# Altium project LimeSDR-XTRX_1v4.PrjPcb (part 5 of 8)
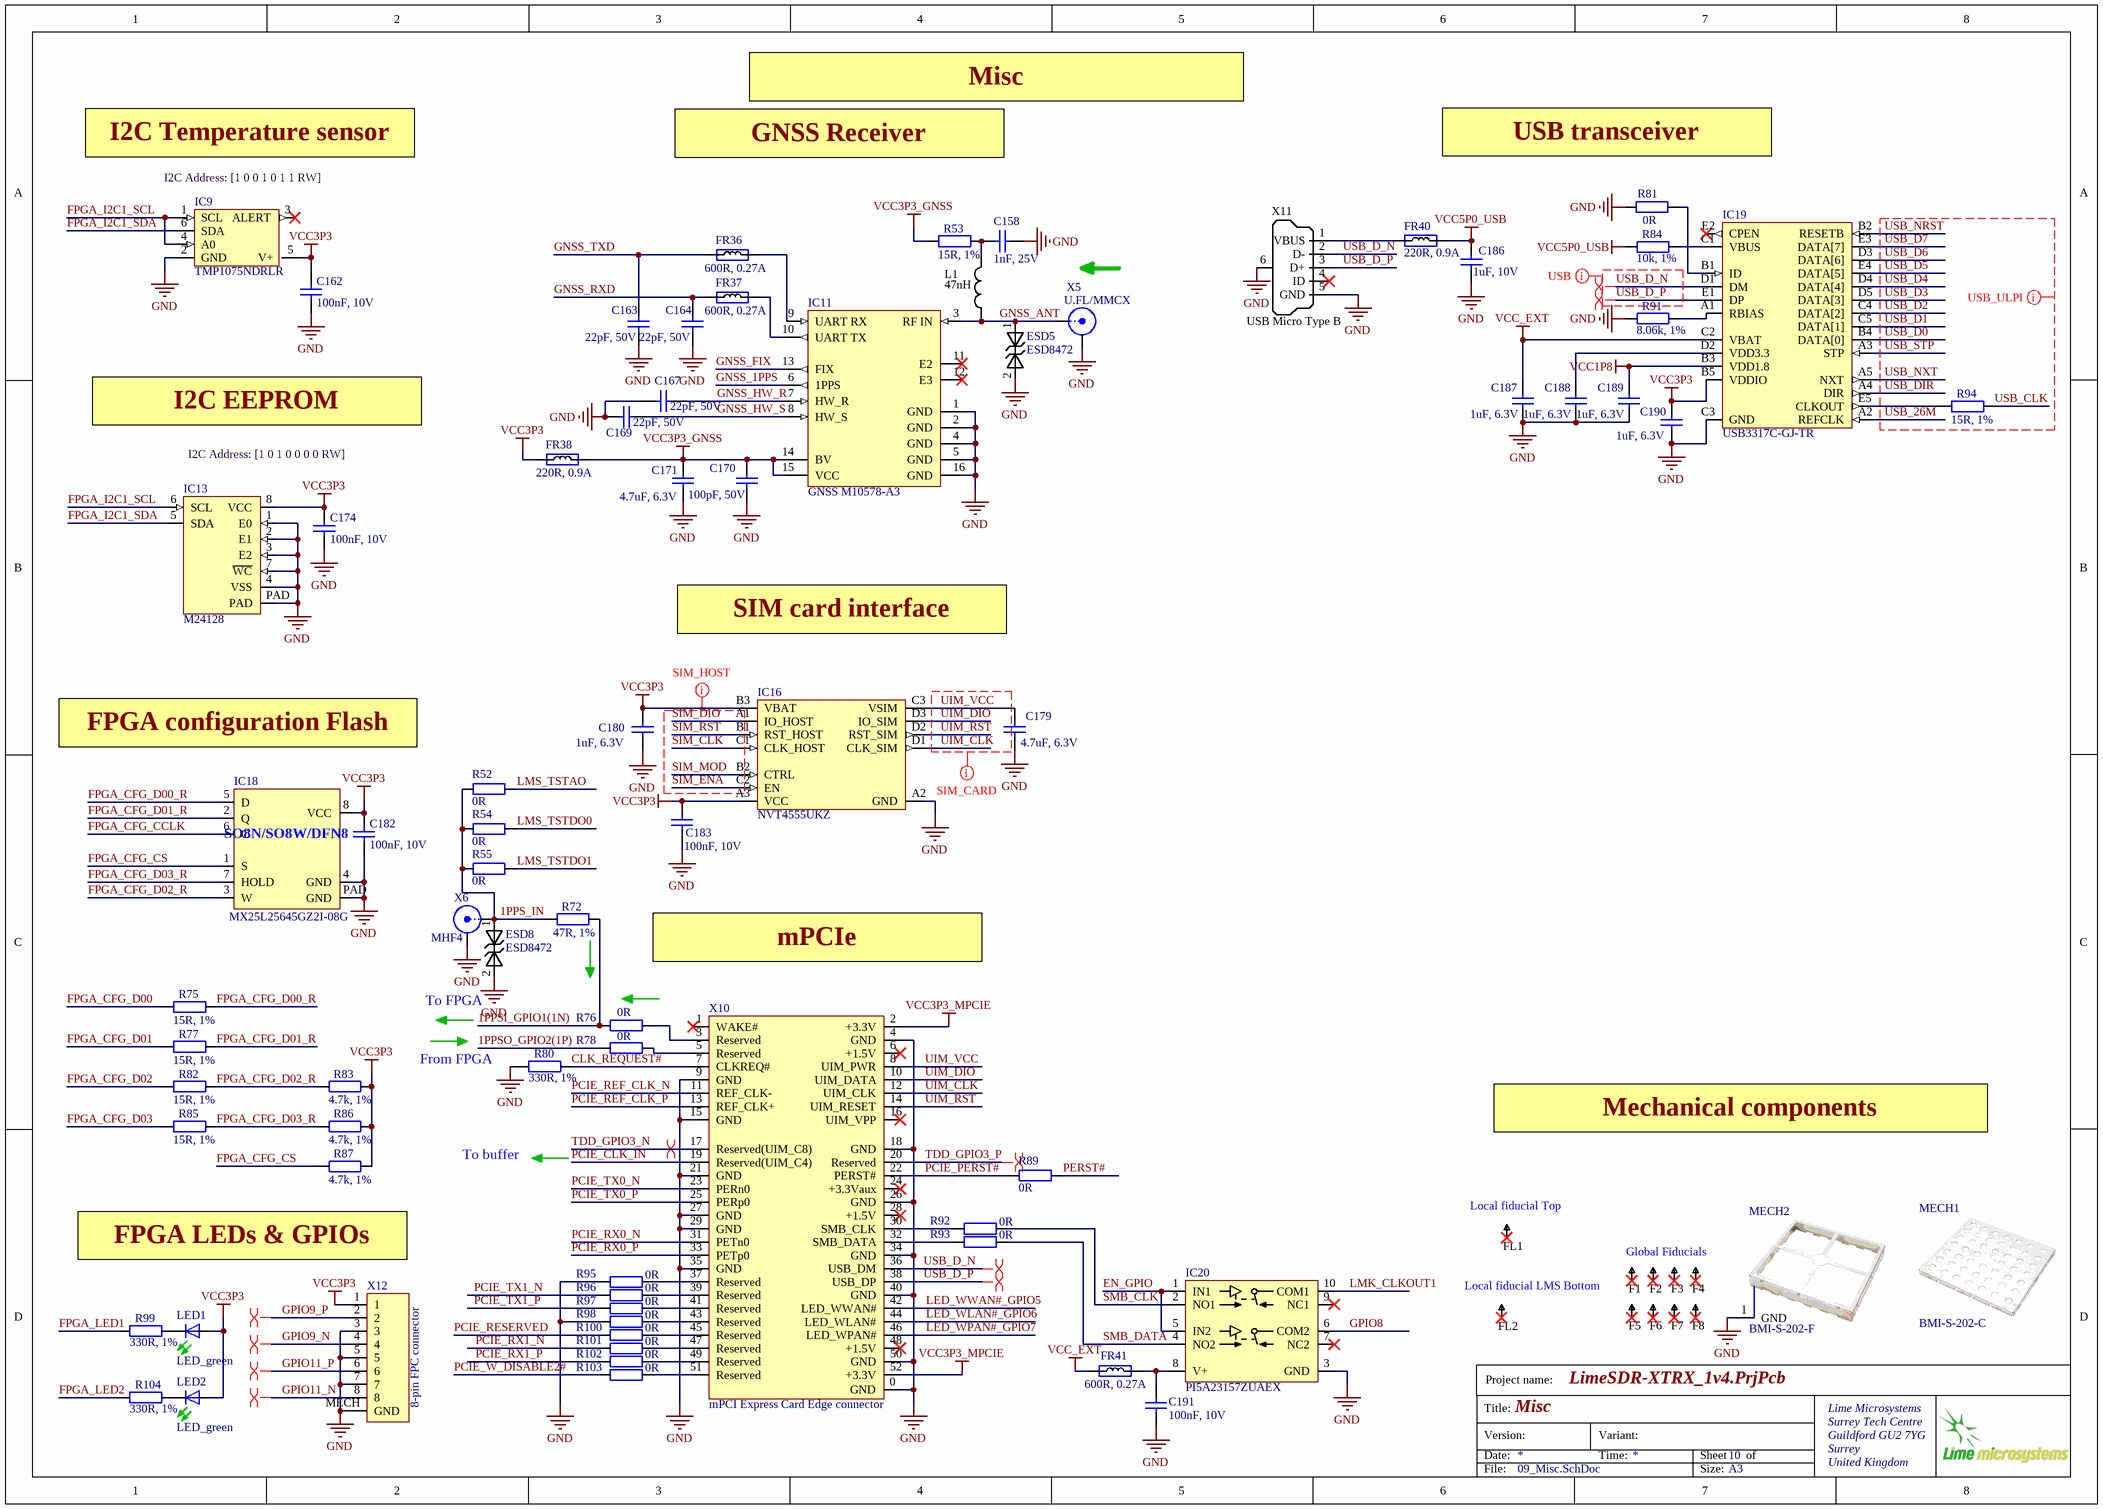
[diagram p11: 09_Misc.SchDoc]

## Sheet 09_Misc.SchDoc: Misc (continued)

### Library data of the parts
C158 = Cap_0402: Manufacturer Part Number 1: C0603X7R1E102K030BA; Manufacturer: TDK Corporation; Part Description: 1000pF ±10% 25V X7R Ceramic Capacitor -55°C ~ 125°C Surface Mount, MLCC 0201 (0603 Metric) 0.024" L x 0.012" W (0.60mm x 0.30mm); Temperature Coefficient: X7R; Tolerance: ±10%; Capacitance: 1000pF; Value: 1nF, 25V; Supplier 1: Digi-Key; Supplier Part Number 1: 445-7275-1-ND; Voltage - Rated: 25V; Features: -; Package / Case: 0201 (0603 Metric); Lead Spacing: -; Mounting Type: Surface Mount, MLCC; Lead Style: -; Height - Seated (Max): -; Operating Temperature: -55°C ~ 125°C; Size / Dimension: 0.024" L x 0.012" W (0.60mm x 0.30mm); Applications: General Purpose; Ratings: -; Thickness (Max): 0.013" (0.33mm); RoHS: RoHS Compliant; Packaging: Cut Tape (CT); Category: Capacitors
C162 C174 C182 C183 C191 = Cap_0402: Part Description: 0.1 µF ±20% 10V Ceramic Capacitor X5R 0201 (0603 Metric); Manufacturer: Samsung; Manufacturer Part Number 1: CL03A104MP3NNNC; Tolerance: 20%; Value: 100nF, 10V; Capacitance: 100nF; Case/Package: 0201; Case Code (Imperial): 0201; Case Code (Metric): 0603; ComponentLink5Description: https://datasheet.ciiva.com/25788/cl03a104mp3nnnc-25788272.pdf?src-supplier=Digi-Key; ComponentLink5URL: https://datasheet.ciiva.com/25788/cl03a104mp3nnnc-25788272.pdf?src-supplier=Digi-Key; Length: 0.024inch; Max Operating Temperature: 85°C; Min Operating Temperature: -55°C; Mount: Surface Mount; Package Quantity: 1; Packaging: Tape and Reel; Pricing 1: 1=0,10000, 10=0,03000, 50=0,01640, 100=0,01330, 500=0,00950, 1000=0,00747, 2500=0,00679, 5000=0,00625 (USD); RoHS: Yes; RoHS Compliant: Yes; Series: CL; Stock 1: 3817176; Supplier 1: Digi-Key; Supplier Part Number 1: 1276-1321-1-ND; Thickness: 0.013inch; Voltage Rating (DC): 10V; Voltage Rating: 10V; Width: 0.012inch
C163 C164 C167 C169 = Cap_0402: Manufacturer: Murata; Manufacturer Part Number 1: GRM0335C1H220JA01D; Part Description: 22 pF ±5% 50V Ceramic Capacitor C0G, NP0 0201 (0603 Metric); Tolerance: 5%; Dielectric: C0G; Value: 22pF, 50V; Supplier 1: Digi-Key; Supplier Part Number 1: 490-6123-1-ND; Stock 1: 2966748; Pricing 1: 1=0,10000, 10=0,01300, 50=0,00720, 100=0,00590, 500=0,00424, 1000=0,00333, 2500=0,00303, 5000=0,00279 (USD); RoHS: Yes; Mount: Surface Mount; Case/Package: 0201; Case Code (Metric): 0603; Case Code (Imperial): 0201; Min Operating Temperature: -55°C; Max Operating Temperature: 125°C; Package Quantity: 15000; Capacitance: 22pF; Voltage Rating: 50V; Packaging: Tape and Reel; Termination: SMD/SMT; Voltage: 50V; Voltage Rating (DC): 50V; Series: GRM; Length: 0.6mm; Width: 0.012inch; Height: 0.3mm; Thickness: 0.013inch; Depth: 0.3mm; Lead Free: Lead Free; RoHS Compliant: Yes; ComponentLink1URL: https://datasheet.ciiva.com/6271/partnumbering-e-01-6271146.pdf?src-supplier=Digi-Key; ComponentLink1Description: https://datasheet.ciiva.com/6271/partnumbering-e-01-6271146.pdf?src-supplier=Digi-Key; ComponentLink2URL: https://datasheet.ciiva.com/6271/partnumbering-e-01-6271143.pdf?src-supplier=Digi-Key; ComponentLink2Description: https://datasheet.ciiva.com/6271/partnumbering-e-01-6271143.pdf?src-supplier=Digi-Key; ComponentLink3URL: https://datasheet.ciiva.com/6271/partnumbering-e-01-6271149.pdf?src-supplier=Digi-Key; ComponentLink3Description: https://datasheet.ciiva.com/6271/partnumbering-e-01-6271149.pdf?src-supplier=Digi-Key
C170 = Cap_0402: Part Description: 100 pF ±5% 50V Ceramic Capacitor C0G, NP0 0201 (0603 Metric); Manufacturer: TDK; Manufacturer Part Number 1: C0603C0G1H101J030BA; Dielectric: C0G; Dielectric Material: Ceramic; Insulation Resistance: 10GR; Tolerance: 5%; Value: 100pF, 50V; Capacitance: 100pF; Case/Package: 0201; Case Code (Imperial): 0201; Case Code (Metric): 0603; ComponentLink1Description: https://datasheet.ciiva.com/24217/c0603c0g1h101j030ba-264106-24217425.pdf?src-supplier=Mouser; ComponentLink1URL: https://datasheet.ciiva.com/24217/c0603c0g1h101j030ba-264106-24217425.pdf?src-supplier=Mouser; ComponentLink2Description: https://datasheet.ciiva.com/16205/mlcc-commercial-general-en-16205590.pdf?src-supplier=Future+Electronics; ComponentLink2URL: https://datasheet.ciiva.com/16205/mlcc-commercial-general-en-16205590.pdf?src-supplier=Future+Electronics; ComponentLink3Description: https://datasheet.ciiva.com/6250/tdkmlcccaprange-6250351.pdf?src-supplier=Digi-Key; ComponentLink3URL: https://datasheet.ciiva.com/6250/tdkmlcccaprange-6250351.pdf?src-supplier=Digi-Key; Construction: Flat; Depth: 0.3mm; Height: 0.3mm; Lead Free: Lead Free; Length: 0.6mm; Max Operating Temperature: 125°C; Min Operating Temperature: -55°C; Mount: Surface Mount; Number of Pins: 2; Package Quantity: 1; Packaging: Tape and Reel; Pricing 1: 1=0,10000, 10=0,06000, 50=0,03280, 100=0,02670, 500=0,01908, 1000=0,01500, 2500=0,01364, 5000=0,01254 (USD); Reach SVHC Compliant: Yes; RoHS: Yes; RoHS Compliant: Yes; Series: C; Stock 1: 367528; Supplier 1: Digi-Key; Supplier Part Number 1: 445-1786-1-ND; Termination: SMD/SMT; Thickness: 0.013inch; Voltage: 50V; Voltage Rating (DC): 50V; Voltage Rating: 50V; Weight: 6E-06oz; Width: 0.012inch
C171 C179 = Cap_0402: Manufacturer: Murata Electronics North America; Manufacturer Part Number 1: GRM155R60J475ME87D; Part Description: 4.7µF ±20% 6.3V X5R Ceramic Capacitor -55°C ~ 85°C Surface Mount, MLCC 0402 (1005 Metric) 0.039" L x 0.020" W (1.00mm x 0.50mm); Tolerance: ±20%; Capacitance: 4.7µF; Temperature Coefficient: X5R; Lead Style: -; Ratings: -; Height - Seated (Max): -; Thickness (Max): 0.022" (0.55mm); Voltage - Rated: 6.3V; Packaging: Cut Tape (CT); Lead Spacing: -; Category: Capacitors; Supplier Part Number 1: 490-5408-1-ND; Applications: General Purpose; Operating Temperature: -55°C ~ 85°C; Mounting Type: Surface Mount, MLCC; Features: Derating Recommended; RoHS: RoHS Compliant; Supplier 1: Digi-Key; Package / Case: 0402 (1005 Metric); Size / Dimension: 0.039" L x 0.020" W (1.00mm x 0.50mm); Value: 4.7uF, 6.3V
C180 C187-C190 = Cap_0402: Manufacturer: TDK Corporation; Manufacturer Part Number 1: JMK063ABJ105MP-F; Part Description: 1µF ±20% 6.3V X5R Ceramic Capacitor -55°C ~ 85°C Surface Mount, MLCC 0201 (0603 Metric) 0.024" L x 0.012" W (0.60mm x 0.30mm); Value: 1uF, 20%; Tolerance: ±20%; Capacitance: 1.0µF; Temperature Coefficient: X5R; Supplier 1: Digi-Key; Supplier Part Number 1: 587-5864-2-ND; Applications: General Purpose; Features: -; Lead Style: -; Ratings: -; Thickness (Max): -; Lead Spacing: -; Height - Seated (Max): -; Size / Dimension: 0.024" L x 0.012" W (0.60mm x 0.30mm); Mounting Type: Surface Mount, MLCC; Operating Temperature: -55°C ~ 85°C; Package / Case: 0201 (0603 Metric); Packaging: Cut Tape (CT); Voltage - Rated: 6.3V; Category: Capacitors; RoHS: RoHS Compliant
C186 = Cap_0402: Manufacturer Part Number 1: C1005X5R1E105K050BC; Manufacturer: TDK; Part Description: 1µF ±10% 10V X5R Ceramic Capacitor -55°C ~ 85°C Surface Mount, MLCC 0402 (1005 Metric) 0.039" L x 0.020" W (1.00mm x 0.50mm); Voltage Rating: 10; Capacitance Tolerance: ± 10%; Product Range: TDK - C Series; Ceramic Capacitor Case: 0402 [1005 Metric]; Capacitance: 1; Dielectric Characteristic: X6; Value: 1uF, 10V; Supplier 1: Digi-Key; Supplier Part Number 1: 445-9066-1-ND; MSL: -; RoHS: YES
ESD5 ESD8 = ESD8472: Manufacturer: ON Semiconductor; Manufacturer Part Number 1: ESD8472MUT5G; Part Description: TVS DIODE 5.3VWM 14VC X3DFN2; Voltage - Reverse Standoff (Typ): 5.3V (Max); Voltage - Breakdown (Min): 7V; Voltage - Clamping (Max) @ Ipp: 14V; Current - Peak Pulse (10/1000µs): 3A (8/20µs); Power Line Protection: No; Capacitance @ Frequency: 0.2pF @ 1MHz; Supplier 1: Digi-Key; RoHS: RoHS Compliant; Category: Circuit Protection; Stock 1: 2295; Pricing 1: 1=0.39, 10=0.315, 100=0.2142, 500=0.16068, 1000=0.12051 (USD); Packaging: Cut Tape (CT); Part Status: Active; Type: Zener; Power - Peak Pulse: -; Applications: Automotive, RF Antenna; Operating Temperature: -55°C ~ 150°C (TJ); Mounting Type: Surface Mount; Package / Case: 2-XFDFN; Supplier Device Package: 2-X3DFN (0.62x0.32); ComponentLink1URL: http://www.onsemi.com/pub/Collateral/ESD8472-D.PDF; ComponentLink1Description: http://www.onsemi.com/pub/Collateral/ESD8472-D.PDF; Supplier Part Number 1: ESD8472MUT5GOSCT-ND
FR36 FR37 = Ferrite: Manufacturer Part Number 1: BK0603TS601-T; Manufacturer: Taiyo Yuden; Part Description: FERRITE BEAD 600 OHM 0201 1LN; DC Resistance (DCR): 750 mOhm Max; Filter Type: Differential Mode - Single; Impedance @ Frequency: 600 Ohm @ 100MHz; Current Rating: 270mA; Value: 600R@100MHz; Supplier 1: Digi-Key; Supplier Part Number 1: 587-3277-1-ND; Size / Dimension: 0.024" L x 0.012" W (0.60mm x 0.30mm); Package / Case: 0201 (0603 Metric); Height (Max): 0.013" (0.33mm); Mounting Type: Surface Mount; Packaging: Cut Tape (CT); RoHS: RoHS Compliant; Category: Filters
FR38 FR40 = Ferrite: Manufacturer: TDK Corporation; Manufacturer Part Number 1: MPZ1005S221ET000; Part Description: FERRITE BEAD 220 OHM 0402 1LN; Impedance @ Frequency: 220 Ohm @ 100MHz; Current Rating: 900mA; DC Resistance (DCR): 220 mOhm Max; Supplier 1: Digi-Key; Package / Case: 0402 (1005 Metric); Category: Filters; Supplier Part Number 1: 445-9329-2-ND; Value: 220R, 0.9A
FR41 = Ferrite: Manufacturer Part Number 1: BK0603TS601-T; Manufacturer: Taiyo Yuden; Part Description: FERRITE BEAD 600 OHM 0201 1LN; DC Resistance (DCR): 750 mOhm Max; Filter Type: Differential Mode - Single; Impedance @ Frequency: 600 Ohm @ 100MHz; Current Rating: 270mA; Supplier 1: Digi-Key; Supplier Part Number 1: 587-3277-1-ND; Size / Dimension: 0.024" L x 0.012" W (0.60mm x 0.30mm); Package / Case: 0201 (0603 Metric); Height (Max): 0.013" (0.33mm); Mounting Type: Surface Mount; Packaging: Cut Tape (CT); RoHS: RoHS Compliant; Category: Filters; Value: 600R, 0.27A
IC9 = TMP1075NDRLR_temperature_sensor: Part Description: Temperature Sensor Digital, Local -40°C ~ 125°C 12 b SOT-563; Manufacturer: Texas Instruments; Supplier 1: Digi-Key; Supplier Part Number 1: 296-TMP1075NDRLRCT-ND; Manufacturer Part Number 1: TMP1075NDRLR; Stock 1: 3405; Pricing 1: 1=0,67000, 5=0,63800, 10=0,55500, 25=0,48760, 50=0,40500, 100=0,34500, 500=0,30000, 1000=0,26250 (USD); RoHS: No; RoHS Compliant: Yes
IC11 = M10578-A3_GPS_GNSS: Manufacturer: Antenova; Part Description: RADIONOVA RF Receiver GPS 1.575GHz -165dBm Module; Frequency: 1.575GHz; Sensitivity: -165dBm; Modulation or Protocol: GPS; Current - Receiving: 28mA; Data Interface: UART; Voltage - Supply: 3.3V; Supplier 1: Digi-Key; Manufacturer Part Number 1: M10578-A3; RoHS: RoHS Compliant; Category: RF/IF and RFID; Stock 1: 0; Pricing 1: 1=17.75, 10=16.061, 25=14.7928, 100=13.5248, 250=12.67952, 500=11.8342 (USD); Packaging: Cut Tape (CT); Part Status: Active; Data Rate (Max): -; Applications: General Purpose; Memory Size: -; Antenna Connector: -; Features: -; Operating Temperature: -40°C ~ 85°C; Package / Case: Module; Supplier Device Package: Module; ComponentLink1URL: http://www.antenova-m2m.com/wp-content/uploads/2015/12/GPS_Radionova_M10578-A3-PS-1.0.pdf; ComponentLink1Description: http://www.antenova-m2m.com/wp-content/uploads/2015/12/GPS_Radionova_M10578-A3-PS-1.0.pdf; Supplier Part Number 1: 627-1074-1-ND
IC13 = M24128-DFMC6TG: Manufacturer: STMicroelectronics; Part Description: EEPROM Memory IC 128Kb (16K x 8) I²C 1MHz 450ns 8-UFDFPN (2x3); Memory Type: Non-Volatile; Memory Format: EEPROM; Memory Size: 128Kb (16K x 8); Write Cycle Time - Word, Page: 5ms; Memory Interface: I²C; Voltage - Supply: 1.7 V ~ 5.5 V; Supplier 1: Digi-Key; Manufacturer Part Number 1: M24128-DFMC6TG; RoHS: RoHS Compliant; Category: Integrated Circuits (ICs); Stock 1: 5894; Pricing 1: 1=0.35, 10=0.348, 100=0.2854, 500=0.27748, 1000=0.27004 (USD); Packaging: Cut Tape (CT); Part Status: Active; Technology: EEPROM; Operating Temperature: -40°C ~ 85°C (TA); Mounting Type: Surface Mount; Package / Case: 8-UFDFN Exposed Pad; Supplier Device Package: 8-UFDFPN (2x3); ComponentLink1URL: http://www.st.com/content/ccc/resource/technical/document/datasheet/59/05/c9/5b/7b/41/48/b6/CD00259167.pdf/files/CD00259167.pdf/jcr:content/translations/en.CD00259167.pdf; ComponentLink1Description: http://www.st.com/content/ccc/resource/technical/document/datasheet/59/05/c9/5b/7b/41/48/b6/CD00259167.pdf/files/CD00259167.pdf/jcr:content/translations/en.CD00259167.pdf; Supplier Part Number 1: 497-15739-1-ND
IC16 = NVT4555UKZ_SIM_INTERFACE: Part Description: SIM Card Interface 12-WLCSP (1.20x1.60); Manufacturer: NXP Semiconductors; Operating Supply Current: 5uA; Max Supply Voltage: 3.6V; Supplier 1: Digi-Key; Supplier Part Number 1: 568-11436-1-ND; Manufacturer Part Number 1: NVT4555UKZ; Stock 1: 2519; Pricing 1: 1=1,59000, 10=1,41900, 25=1,34720, 100=1,10660, 250=1,03440, 500=0,91410, 1000=0,76061 (USD); RoHS: Yes; Mount: Surface Mount; Number of Pins: 12; Weight: 0.002328oz; Min Operating Temperature: -40°C; Max Operating Temperature: 85°C; Packaging: Tape and Reel; Package Quantity: 3000; RoHS Compliant: Yes; ComponentLink1URL: http://www.mouser.com/ds/2/302/NVT4555-527699.pdf?src-supplier=Mouser; ComponentLink1Description: http://www.mouser.com/ds/2/302/NVT4555-527699.pdf?src-supplier=Mouser
IC18 = M25P40_with_pad: Part Description: FLASH - NOR Memory IC 256Mbit SPI 120 MHz 8-WSON (8x6); Manufacturer: Macronix; Memory Type: Non-Volatile,FLASH; Memory Size: 256Mb; Frequency: 120MHz; ComponentLink1URL: http://www.winbond.com/resource-files/w25q128jv%20revf%2003272018%20plus.pdf?src-supplier=Digi-Key; ComponentLink1Description: http://www.winbond.com/resource-files/w25q128jv%20revf%2003272018%20plus.pdf?src-supplier=Digi-Key; ComponentLink2URL: http://www.macronix.com/Lists/Datasheet/Attachments/7549/MX25L25645G,%203V,%20256Mb,%20v1.7.pdf?src-supplier=Digi-Key; ComponentLink2Description: http://www.macronix.com/Lists/Datasheet/Attachments/7549/MX25L25645G,%203V,%20256Mb,%20v1.7.pdf?src-supplier=Digi-Key; ComponentLink3URL: http://ckassoc.com/oldsite/pdf/Macronix_Product_Line_Card_July_2017_General%20_070617.pdf?src-supplier=Digi-Key; ComponentLink3Description: http://ckassoc.com/oldsite/pdf/Macronix_Product_Line_Card_July_2017_General%20_070617.pdf?src-supplier=Digi-Key; Value: MX25L25645GZ2I-08G; Supplier 1: Digi-Key; Supplier Part Number 1: 1092-1237-ND; Manufacturer Part Number 1: MX25L25645GZ2I-08G; Stock 1: 23084; Pricing 1: 1=4,06000, 10=3,68400, 25=3,60360, 40=3,58400, 80=3,21363, 230=3,20191, 480=3,08490, 960=2,93280 (USD); RoHS: Yes; Mount: Surface Mount; Case/Package: SOIC; Min Operating Temperature: -40°C; Max Operating Temperature: 85°C; RoHS Compliant: Yes; ComponentLink4URL: http://www.macronix.com/Lists/Datasheet/Attachments/7444/MX25L25673G,%203V,%20256Mb,%20v1.4.pdf?src-supplier=Digi-Key; ComponentLink4Description: http://www.macronix.com/Lists/Datasheet/Attachments/7444/MX25L25673G,%203V,%20256Mb,%20v1.4.pdf?src-supplier=Digi-Key
IC19 = USB3317C-GJ-TR_USB2_transceiver: Part Description: IC TXRX USB 2.0 FLEXPWR 25BGA; Manufacturer: Microchip; Manufacturer Lifecycle Status: REL; Max Dual Supply Voltage: 5.5V; Number of Transceivers: 1; Supplier 1: DigiKey; Supplier Part Number 1: 150-USB3317C-GJ-TRCT-ND; Manufacturer Part Number 1: USB3317C-GJ-TR; Stock 1: 1646; Pricing 1: 1=2,07, 25=1,836 (USD); RoHS: Compliant; Projected EOL Date: 2034-04-15; Country of Assembly: Taiwan; Country of Fabrication: United States of America; Country of Origin: Taiwan; Export Control Classification Number (ECCN) Code: EAR99; HS Code: 8542.39.0090; Harmonized Tariff Schedule (HTS) Code: 8542.31.0030; Lifecycle Status: Production; Max Operating Temperature: 85°C; Min Operating Temperature: -40°C; Mount: Surface Mount; Number of Pins: 25; Radiation Hardening: No; ComponentLink1URL: https://datasheet.octopart.com:443/USB3317C-GJ-TR-Microchip-datasheet-99356273.pdf?src-supplier=Microchip; ComponentLink1Description: https://datasheet.octopart.com:443/USB3317C-GJ-TR-Microchip-datasheet-99356273.pdf?src-supplier=Microchip; ComponentLink2URL: https://datasheet.octopart.com:443/USB3317C-GJ-TR-Microchip-datasheet-110745152.pdf?src-supplier=Augswan; ComponentLink2Description: https://datasheet.octopart.com:443/USB3317C-GJ-TR-Microchip-datasheet-110745152.pdf?src-supplier=Augswan; ComponentLink3URL: http://sigma.octopart.com:80/188457950/materials_sheet/Microchip-USB3317C-GJ-TR.pdf?src-supplier=Compliance+Statements; ComponentLink3Description: http://sigma.octopart.com:80/188457950/materials_sheet/Microchip-USB3317C-GJ-TR.pdf?src-supplier=Compliance+Statements; ComponentLink4URL: http://sigma.octopart.com:80/rohs_statement/Microchip-company-71.pdf?src-supplier=Compliance+Statements; ComponentLink4Description: http://sigma.octopart.com:80/rohs_statement/Microchip-company-71.pdf?src-supplier=Compliance+Statements; ComponentLink5URL: http://sigma.octopart.com:80/reach_statement/Microchip-company-70.pdf?src-supplier=Compliance+Statements; ComponentLink5Description: http://sigma.octopart.com:80/reach_statement/Microchip-company-70.pdf?src-supplier=Compliance+Statements; ComponentLink6URL: http://sigma.octopart.com:80/conflict_mineral_statement/Microchip-company-69.pdf?src-supplier=Compliance+Statements; ComponentLink6Description: http://sigma.octopart.com:80/conflict_mineral_statement/Microchip-company-69.pdf?src-supplier=Compliance+Statements; ComponentLink7URL: http://sigma.octopart.com:80/conflict_mineral_statement/Microchip-company-68.pdf?src-supplier=Compliance+Statements; ComponentLink7Description: http://sigma.octopart.com:80/conflict_mineral_statement/Microchip-company-68.pdf?src-supplier=Compliance+Statements
IC20 = PI5A23157ZUAEX_SPDT_SW: Manufacturer: Diodes; Part Description: 2 Circuit IC Switch 2:1 15Ohm 10-UQFN (1.5x2); Supplier 1: Digi-Key; Supplier Part Number 1: 31-PI5A23157ZUAEXCT-ND; Manufacturer Part Number 1: PI5A23157ZUAEX; Stock 1: 2985; Pricing 1: 1=0,87000, 10=0,77000, 25=0,72280, 100=0,59000, 250=0,54800, 500=0,46640, 1000=0,37312 (USD); RoHS: No
L1 = Inductor_0603: Manufacturer: COILCRAFT; Manufacturer Part Number: 0402HP-47NXJLU; Part Description: INDUCTOR, RF, 47NH, 5%, 2.4GHZ, SMD; Product Range:0402HP Series; Inductance:47nH; Inductance Tolerance:± 5%; High Frequency Inductor Case:0402 [1005 Metric]; Self Resonant Frequency Min:2.4GHz; DC Resistance Max:0.58ohm; DC Current Rating:420mA; SVHC: No SVHC (15-Jun-2015); Inductance Tolerance: ± 5%; High Frequency Inductor Case: 0402 [1005 Metric]; Inductance: 47; DC Resistance Max: 0.58; Self Resonant Frequency Min: 2.4; Product Range: 0402; DC Current Rating: 420; Inductor Construction: Wirewound; Supplier 1: Farnell; Supplier Part Number 1: 2285856; Packaging: Cut Tape; Inductor Case Style: 0402 [1005 Metric]; RoHS: Y-EX; value: 47nH; Manufacturer Part Number 1: 0402HP-47NXJLU
LED1 LED2 = LED_green: Part Description: Green 571nm LED Indication - Discrete 1.97V 2-SMD, 0201; Manufacturer: Kingbright; Manufacturer Part Number 1: APG0603CGC-TT; Color: Green; Lens Color: Colorless; Lens Transparency: Clear; Luminous Intensity: 15mcd; Test Current: 10mA; Viewing Angle: 140°; Dominant Wavelength: 571nm; Forward Voltage: 1.97V; ComponentLink1URL: http://www.kingbrightusa.com/images/catalog/SPEC/APG0603CGC-TT.pdf?src-supplier=Digi-Key; ComponentLink1Description: http://www.kingbrightusa.com/images/catalog/SPEC/APG0603CGC-TT.pdf?src-supplier=Digi-Key; Supplier 1: Digi-Key; Supplier Part Number 1: 754-2021-1-ND; Stock 1: 18826; Pricing 1: 1=0,50000, 10=0,30500, 100=0,17530, 1000=0,13720, 2000=0,12577 (USD); RoHS: Yes; Mount: Surface Mount; Case/Package: SMD/SMT; Packaging: Tape and Reel; Length: 0.65mm; Width: 0.35mm; Height: 0.25mm; Lead Free: Lead Free; RoHS Compliant: Yes
MECH1 = RFI_SHIELD_COVER_BMI-S-202-C: Part Description: RF Shield Cover 0.668" (16.96mm) X 0.668" (16.96mm) Vent Holes in Pattern Snap Fit; Manufacturer: Laird; ComponentLink1URL: https://www.leadertechinc.com/assets/files/EngineeringDrawings/SMS-206.PDF; ComponentLink1Description: https://www.leadertechinc.com/assets/files/EngineeringDrawings/SMS-206.PDF; Supplier 1: Digi-Key; Supplier Part Number 1: 903-1014-ND; Manufacturer Part Number 1: BMI-S-202-C; Stock 1: 245970; Pricing 1: 1=1,68000, 10=1,51300, 25=1,42760, 100=1,21620, 250=1,14200, 500=0,99924, 1000=0,82795, 2500=0,77085, 5000=0,74230 (USD); RoHS: Yes; Color: Grey; Material: Aluminium; Package Quantity: 1400; Packaging: Bulk; Series: SMT 2 Piece; Length: 16.5mm; Width: 16.5mm; Depth: 3.6mm; ComponentLink2URL: http://www.farnell.com/datasheets/1965028.pdf?src-supplier=Farnell; ComponentLink2Description: http://www.farnell.com/datasheets/1965028.pdf?src-supplier=Farnell; ComponentLink3URL: http://www.mouser.com/ds/2/223/Laird_BMIS_201_210-201562.pdf?src-supplier=Mouser; ComponentLink3Description: http://www.mouser.com/ds/2/223/Laird_BMIS_201_210-201562.pdf?src-supplier=Mouser; ComponentLink4URL: http://www.farnell.com/datasheets/1965028.pdf?src-supplier=Newark; ComponentLink4Description: http://www.farnell.com/datasheets/1965028.pdf?src-supplier=Newark; ComponentLink5URL: http://www.farnell.com/datasheets/1965028.pdf?src-supplier=Element14; ComponentLink5Description: http://www.farnell.com/datasheets/1965028.pdf?src-supplier=Element14; ComponentLink6URL: http://assets.lairdtech.com/home/brandworld/files/Board%20Level%20Shields%20Catalog%20Download.pdf?src-supplier=Digi-Key; ComponentLink6Description: http://assets.lairdtech.com/home/brandworld/files/Board%20Level%20Shields%20Catalog%20Download.pdf?src-supplier=Digi-Key; ComponentLink7URL: http://assets.lairdtech.com/home/brandworld/files/Board%20Level%20Shields%20Catalog%20Download.pdf?src-supplier=Quest; ComponentLink7Description: http://assets.lairdtech.com/home/brandworld/files/Board%20Level%20Shields%20Catalog%20Download.pdf?src-supplier=Quest
MECH2 = RFI_SHIELD_FRAME_BMI-S-202-F: Part Description: RF Shield Frame 0.650" (16.50mm) X 0.650" (16.50mm) Surface Mount; Manufacturer: Laird; ComponentLink1URL: https://www.leadertechinc.com/assets/files/EngineeringDrawings/SMS-206.PDF; ComponentLink1Description: https://www.leadertechinc.com/assets/files/EngineeringDrawings/SMS-206.PDF; Supplier 1: Digi-Key; Supplier Part Number 1: 903-1051-1-ND; Manufacturer Part Number 1: BMI-S-202-F; Stock 1: 239502; Pricing 1: 1=1,94000, 10=1,74100, 25=1,64280, 100=1,39970, 250=1,31428 (USD); RoHS: Yes; Mount: Solder; Material: Aluminium; Color: Grey; Package Quantity: 700; Packaging: Tape and Reel; Length: 16.5mm; Width: 16.5mm; Depth: 3.6mm; Reach SVHC Compliant: Unknown; ComponentLink2URL: https://datasheet.ciiva.com/2799/bmi-s-202-2799404.pdf?src-supplier=Digi-Key; ComponentLink2Description: https://datasheet.ciiva.com/2799/bmi-s-202-2799404.pdf?src-supplier=Digi-Key
R52 R54 R55 R76 R78 R81 R89 R92 R93 R95-R98 R100-R103 = Res_0402: Part Description: 0 Ohms Jumper Chip Resistor 0201 (0603 Metric) Moisture Resistant Thick Film; Manufacturer: Yageo; Manufacturer Part Number 1: RC0201JR-070RL; Power Rating: 50mW; Tolerance: 5%; Voltage Rating: 25V; ComponentLink1URL: http://www.yageo.com/documents/recent/PYu-RC_Group_51_RoHS_L_7.pdf; ComponentLink1Description: http://www.yageo.com/documents/recent/PYu-RC_Group_51_RoHS_L_7.pdf; Value: 0R; Supplier 1: Digi-Key; Supplier Part Number 1: 311-0.0NCT-ND; Stock 1: 6252381; Pricing 1: 1=0,10000, 10=0,03700, 25=0,02680, 50=0,02020, 100=0,01500, 250=0,01140, 500=0,00912, 1000=0,00672, 5000=0,00482 (USD); RoHS: Yes; Case/Package: 0201; Case Code (Metric): 0603; Case Code (Imperial): 0201; Weight: 6E-06oz; Contact Plating: Tin,Matte; Size Code: 0201; Min Operating Temperature: -55°C; Max Operating Temperature: 125°C; Packaging: Tape and Reel; Resistance: 0R; Package Quantity: 1; Resistor Type: Thick Film; Number of Terminations: 2; Termination: SMD/SMT; Max Power Dissipation: 50mW; Voltage Rating (DC): 25V; Features: Moisture Resistant; Series: RC; Construction: Rectangular; Resistance Tolerance: 5%; Length: 0.024inch; Width: 0.012inch; Height: 0.01inch; Depth: 0.3mm; Radiation Hardening: No; Military Standard: Not; Lead Free: Lead Free; RoHS Compliant: Yes; ComponentLink2URL: https://datasheet.ciiva.com/7672/1563626-7672248.pdf?src-supplier=Element14; ComponentLink2Description: https://datasheet.ciiva.com/7672/1563626-7672248.pdf?src-supplier=Element14; ComponentLink3URL: https://datasheet.ciiva.com/7672/1563626-7672247.pdf?src-supplier=Element14; ComponentLink3Description: https://datasheet.ciiva.com/7672/1563626-7672247.pdf?src-supplier=Element14; ComponentLink4URL: https://datasheet.ciiva.com/7660/1421516-7660808.pdf?src-supplier=Element14; ComponentLink4Description: https://datasheet.ciiva.com/7660/1421516-7660808.pdf?src-supplier=Element14; ComponentLink5URL: https://datasheet.ciiva.com/46391/1421516-46391340.pdf?src-supplier=Element14; ComponentLink5Description: https://datasheet.ciiva.com/46391/1421516-46391340.pdf?src-supplier=Element14
R53 R75 R77 R82 R85 R94 = Res_0402: Manufacturer: Yageo; Manufacturer Part Number 1: RC0201FR-0715RL; Part Description: 15 Ohms ±1% 0.05W, 1/20W Chip Resistor 0201 (0603 Metric) Moisture Resistant Thick Film; Power Rating: 50mW; Voltage Rating: 25V; Temperature Coefficient: 200ppm/°C; Value: 15R, 1%; ComponentLink1URL: https://datasheet.ciiva.com/5924/1563626-5924912.pdf?src-supplier=Farnell; ComponentLink1Description: https://datasheet.ciiva.com/5924/1563626-5924912.pdf?src-supplier=Farnell; ComponentLink2URL: https://datasheet.ciiva.com/22661/1563626-22661319.pdf?src-supplier=Element14; ComponentLink2Description: https://datasheet.ciiva.com/22661/1563626-22661319.pdf?src-supplier=Element14; Supplier 1: Digi-Key; Supplier Part Number 1: 311-15.0MCT-ND; Stock 1: 379739; Pricing 1: 1=0,10000, 10=0,03700, 100=0,01530, 1000=0,00685, 2500=0,00595, 5000=0,00491 (USD); RoHS: Yes; Case/Package: 0201; Case Code (Imperial): 0201; Case Code (Metric): 0603; Size Code: 0201; Min Operating Temperature: -55°C; Max Operating Temperature: 125°C; Resistance: 15R; Tolerance: 1%; Packaging: Cut Tape; Package Quantity: 1; Termination: SMD/SMT; Resistor Type: Thick Film; Number of Terminations: 2; Max Power Dissipation: 50mW; Features: Moisture Resistant; Series: RC; Resistance Tolerance: 1%; Length: 0.6mm; Width: 0.3mm; Height: 0.23mm; Lead Free: Lead Free; RoHS Compliant: Yes; ComponentLink3URL: https://datasheet.ciiva.com/7672/1563626-7672202.pdf?src-supplier=Element14; ComponentLink3Description: https://datasheet.ciiva.com/7672/1563626-7672202.pdf?src-supplier=Element14; ComponentLink4URL: https://datasheet.ciiva.com/2493/pyu-r-int-thick-7-2493785.pdf?src-supplier=Digi-Key; ComponentLink4Description: https://datasheet.ciiva.com/2493/pyu-r-int-thick-7-2493785.pdf?src-supplier=Digi-Key; ComponentLink5URL: https://datasheet.ciiva.com/2493/pyu-r-int-thick-7-2493786.pdf?src-supplier=Digi-Key; ComponentLink5Description: https://datasheet.ciiva.com/2493/pyu-r-int-thick-7-2493786.pdf?src-supplier=Digi-Key; ComponentLink6URL: https://datasheet.ciiva.com/2493/pyu-r-int-thick-7-2493784.pdf?src-supplier=Digi-Key; ComponentLink6Description: https://datasheet.ciiva.com/2493/pyu-r-int-thick-7-2493784.pdf?src-supplier=Digi-Key
R72 = Res_0402: Manufacturer: Yageo; Manufacturer Part Number 1: RC0201FR-0747RL; Part Description: 47 Ohms ±1% 0.05W, 1/20W Chip Resistor 0201 (0603 Metric) Moisture Resistant Thick Film; Power Rating: 50mW; Voltage Rating: 25V; Temperature Coefficient: 200ppm/°C; Value: 47R, 1%; Supplier 1: Digi-Key; Supplier Part Number 1: YAG2694CT-ND; Stock 1: 778022; Pricing 1: 1=0,10000, 10=0,03700, 100=0,01530, 1000=0,00685, 2500=0,00595, 5000=0,00491 (USD); RoHS: Yes; Case/Package: 0201; Case Code (Imperial): 0201; Case Code (Metric): 0603; Min Operating Temperature: -55°C; Max Operating Temperature: 125°C; Packaging: Tape and Reel; Resistance: 47R; Tolerance: 1%; Resistor Type: Thick Film; Termination: SMD/SMT; Number of Terminations: 2; Max Power Dissipation: 50mW; Features: Moisture Resistant; Series: RC; Resistance Tolerance: 1%; Length: 0.6mm; Width: 0.3mm; Height: 0.23mm; Reach SVHC Compliant: Yes; RoHS Compliant: Yes; ComponentLink1URL: https://datasheet.ciiva.com/5924/1563626-5924912.pdf?src-supplier=Farnell; ComponentLink1Description: https://datasheet.ciiva.com/5924/1563626-5924912.pdf?src-supplier=Farnell; ComponentLink2URL: https://datasheet.ciiva.com/22661/1563626-22661319.pdf?src-supplier=Element14; ComponentLink2Description: https://datasheet.ciiva.com/22661/1563626-22661319.pdf?src-supplier=Element14
R80 R99 R104 = Res_0402: Part Description: 330 Ohms ±1% 0.05W, 1/20W Chip Resistor 0201 (0603 Metric) Thick Film; Manufacturer: Vishay Dale; Manufacturer Part Number 1: CRCW0201330RFKED; Power Rating: 50mW; Voltage Rating: 30V; Temperature Coefficient: 100ppm/°C; Value: 330R, 1%; Supplier 1: Digi-Key; Supplier Part Number 1: 541-330AABCT-ND; Stock 1: 245078; Pricing 1: 1=0,27000, 10=0,23000, 100=0,08990, 1000=0,03762, 2500=0,03448, 5000=0,03135 (USD); RoHS: Yes; Case/Package: 0201; Weight: 6E-06oz; Case Code (Imperial): 0201; Case Code (Metric): 0603; Contact Plating: Tin; Size Code: 0201; Min Operating Temperature: -55°C; Max Operating Temperature: 155°C; Resistance: 330R; Tolerance: 1%; Packaging: Tape and Reel; Package Quantity: 1; Resistor Type: Thick Film; Number of Terminations: 2; Max Power Dissipation: 50mW; Series: CRCW; Construction: Rectangular; Length: 0.6mm; Width: 0.3mm; Height: 0.011inch; Depth: 0.3mm; Radiation Hardening: No; Military Standard: Not; Lead Free: Lead Free; RoHS Compliant: Yes; ComponentLink1URL: https://datasheet.ciiva.com/8944/crcw0201e3-8944937.pdf?src-supplier=Avnet; ComponentLink1Description: https://datasheet.ciiva.com/8944/crcw0201e3-8944937.pdf?src-supplier=Avnet; ComponentLink2URL: https://datasheet.ciiva.com/2473/crcw0201e3-2473436.pdf?src-supplier=Digi-Key; ComponentLink2Description: https://datasheet.ciiva.com/2473/crcw0201e3-2473436.pdf?src-supplier=Digi-Key; ComponentLink3URL: https://datasheet.ciiva.com/2473/crcw0201e3-2473437.pdf?src-supplier=Digi-Key; ComponentLink3Description: https://datasheet.ciiva.com/2473/crcw0201e3-2473437.pdf?src-supplier=Digi-Key; ComponentLink4URL: https://datasheet.ciiva.com/2473/crcw0201e3-2473438.pdf?src-supplier=Digi-Key; ComponentLink4Description: https://datasheet.ciiva.com/2473/crcw0201e3-2473438.pdf?src-supplier=Digi-Key; ComponentLink5URL: https://datasheet.ciiva.com/16394/dcrcwe3-16394575.pdf?src-supplier=Future+Electronics; ComponentLink5Description: https://datasheet.ciiva.com/16394/dcrcwe3-16394575.pdf?src-supplier=Future+Electronics
R83 R86 R87 = Res_0402: Manufacturer: Yageo; Manufacturer Part Number 1: RC0201FR-074K7L; Part Description: 4.7 kOhms ±1% 0.05W, 1/20W Chip Resistor 0201 (0603 Metric) Moisture Resistant Thick Film; Resistance: 4.7kR; Power Rating: 50mW; Voltage Rating: 25V; Temperature Coefficient: 200ppm/°C; Value: 4.7k, 1%; ComponentLink1URL: https://datasheet.ciiva.com/5924/1563626-5924912.pdf?src-supplier=Farnell; ComponentLink1Description: https://datasheet.ciiva.com/5924/1563626-5924912.pdf?src-supplier=Farnell; ComponentLink2URL: https://datasheet.ciiva.com/22661/1563626-22661319.pdf?src-supplier=Element14; ComponentLink2Description: https://datasheet.ciiva.com/22661/1563626-22661319.pdf?src-supplier=Element14; ComponentLink3URL: https://datasheet.ciiva.com/7672/1563626-7672202.pdf?src-supplier=Element14; ComponentLink3Description: https://datasheet.ciiva.com/7672/1563626-7672202.pdf?src-supplier=Element14; ComponentLink4URL: https://datasheet.ciiva.com/2493/pyu-r-int-thick-7-2493785.pdf?src-supplier=Digi-Key; ComponentLink4Description: https://datasheet.ciiva.com/2493/pyu-r-int-thick-7-2493785.pdf?src-supplier=Digi-Key; ComponentLink5URL: https://datasheet.ciiva.com/2493/pyu-r-int-thick-7-2493786.pdf?src-supplier=Digi-Key; ComponentLink5Description: https://datasheet.ciiva.com/2493/pyu-r-int-thick-7-2493786.pdf?src-supplier=Digi-Key; ComponentLink6URL: https://datasheet.ciiva.com/2493/pyu-r-int-thick-7-2493784.pdf?src-supplier=Digi-Key; ComponentLink6Description: https://datasheet.ciiva.com/2493/pyu-r-int-thick-7-2493784.pdf?src-supplier=Digi-Key; ComponentLink7URL: https://datasheet.ciiva.com/7672/1563626-7672233.pdf?src-supplier=Element14; ComponentLink7Description: https://datasheet.ciiva.com/7672/1563626-7672233.pdf?src-supplier=Element14; ComponentLink8URL: https://datasheet.ciiva.com/2493/pyu-r-int-thick-7-2493812.pdf?src-supplier=Digi-Key; ComponentLink8Description: https://datasheet.ciiva.com/2493/pyu-r-int-thick-7-2493812.pdf?src-supplier=Digi-Key; ComponentLink9URL: https://datasheet.ciiva.com/2493/pyu-r-int-thick-7-2493813.pdf?src-supplier=Digi-Key; ComponentLink9Description: https://datasheet.ciiva.com/2493/pyu-r-int-thick-7-2493813.pdf?src-supplier=Digi-Key; ComponentLink10URL: https://datasheet.ciiva.com/2493/pyu-r-int-thick-7-2493811.pdf?src-supplier=Digi-Key; ComponentLink10Description: https://datasheet.ciiva.com/2493/pyu-r-int-thick-7-2493811.pdf?src-supplier=Digi-Key; ComponentLink11URL: https://datasheet.ciiva.com/8892/pyu-rc0201-51-rohs-l-8-8892942.pdf?src-supplier=Avnet; ComponentLink11Description: https://datasheet.ciiva.com/8892/pyu-rc0201-51-rohs-l-8-8892942.pdf?src-supplier=Avnet; Supplier 1: Digi-Key; Supplier Part Number 1: 311-4.70KMCT-ND; Stock 1: 6149397; Pricing 1: 1=0,10000, 10=0,03700, 100=0,01530, 1000=0,00685, 2500=0,00595, 5000=0,00491 (USD); RoHS: Yes; Case/Package: 0201; Case Code (Metric): 0603; Case Code (Imperial): 0201; Weight: 6E-06oz; Contact Plating: Tin,Matte; Size Code: 0201; Min Operating Temperature: -55°C; Max Operating Temperature: 125°C; Tolerance: 1%; Packaging: Tape and Reel; Package Quantity: 1; Resistor Type: Thick Film; Number of Terminations: 2; Termination: SMD/SMT; Max Power Dissipation: 50mW; Features: Moisture Resistant; Series: RC; Resistance Tolerance: 1%; Construction: Rectangular; Length: 0.6mm; Width: 0.012inch; Height: 0.01inch; Depth: 0.3mm; Radiation Hardening: No; Military Standard: Not; Lead Free: Lead Free; RoHS Compliant: Yes
R84 = Res_0402: Manufacturer: Yageo; Manufacturer Part Number 1: RC0201FR-0710KL; Part Description: 10 kOhms ±1% 0.05W, 1/20W Chip Resistor 0201 (0603 Metric) Moisture Resistant Thick Film; Resistance: 10kR; Power Rating: 50mW; Voltage Rating: 25V; Temperature Coefficient: 200ppm/°C; Value: 10k, 1%; ComponentLink1URL: https://datasheet.ciiva.com/5924/1563626-5924912.pdf?src-supplier=Farnell; ComponentLink1Description: https://datasheet.ciiva.com/5924/1563626-5924912.pdf?src-supplier=Farnell; ComponentLink2URL: https://datasheet.ciiva.com/22661/1563626-22661319.pdf?src-supplier=Element14; ComponentLink2Description: https://datasheet.ciiva.com/22661/1563626-22661319.pdf?src-supplier=Element14; Supplier 1: Digi-Key; Supplier Part Number 1: 311-10.0KMCT-ND; Stock 1: 17142315; Pricing 1: 1=0,10000, 10=0,03700, 100=0,01530, 1000=0,00685, 2500=0,00595, 5000=0,00491 (USD); RoHS: Yes; Case/Package: 0201; Number of Pins: 2; Case Code (Imperial): 0201; Case Code (Metric): 0603; Contact Plating: Tin,Matte; Weight: 6E-06oz; Min Operating Temperature: -55°C; Max Operating Temperature: 125°C; Tolerance: 1%; Packaging: Tape and Reel; Package Quantity: 10000; Termination: SMD/SMT; Resistor Type: Thick Film; Number of Terminations: 2; Max Power Dissipation: 50mW; Voltage Rating (DC): 25V; Features: Moisture Resistant; Series: RC; Resistance Tolerance: 1%; Construction: Rectangular; Working Voltage: 25V; Technology: THICK FILM; Length: 0.6mm; Width: 0.012inch; Height: 0.01inch; Depth: 0.3mm; Radiation Hardening: No; Reach SVHC Compliant: Yes; Military Standard: Not; Lead Free: Lead Free; RoHS Compliant: Yes; ComponentLink3URL: https://datasheet.ciiva.com/7660/1421516-7660807.pdf?src-supplier=Element14; ComponentLink3Description: https://datasheet.ciiva.com/7660/1421516-7660807.pdf?src-supplier=Element14; ComponentLink4URL: https://datasheet.ciiva.com/46391/1421516-46391339.pdf?src-supplier=Element14; ComponentLink4Description: https://datasheet.ciiva.com/46391/1421516-46391339.pdf?src-supplier=Element14; ComponentLink5URL: https://datasheet.ciiva.com/2467/pyu-r-int-thick-7-2467110.pdf?src-supplier=Digi-Key; ComponentLink5Description: https://datasheet.ciiva.com/2467/pyu-r-int-thick-7-2467110.pdf?src-supplier=Digi-Key; ComponentLink6URL: https://datasheet.ciiva.com/2467/pyu-r-int-thick-7-2467111.pdf?src-supplier=Digi-Key; ComponentLink6Description: https://datasheet.ciiva.com/2467/pyu-r-int-thick-7-2467111.pdf?src-supplier=Digi-Key; ComponentLink7URL: https://datasheet.ciiva.com/2467/pyu-r-int-thick-7-2467109.pdf?src-supplier=Digi-Key; ComponentLink7Description: https://datasheet.ciiva.com/2467/pyu-r-int-thick-7-2467109.pdf?src-supplier=Digi-Key
R91 = Res_0402: Manufacturer: Yageo; Manufacturer Part Number 1: RC0201FR-078K06L; Part Description: 8.06 kOhms ±1% 0.05W, 1/20W Chip Resistor 0201 (0603 Metric) Moisture Resistant Thick Film; Resistance: 8.06kR; Max Power Dissipation: 50mW; Temperature Coefficient: 200ppm/°C; Value: 8.06k, 1%; ComponentLink1URL: https://datasheet.ciiva.com/5924/1563626-5924912.pdf?src-supplier=Farnell; ComponentLink1Description: https://datasheet.ciiva.com/5924/1563626-5924912.pdf?src-supplier=Farnell; ComponentLink2URL: https://datasheet.ciiva.com/22661/1563626-22661319.pdf?src-supplier=Element14; ComponentLink2Description: https://datasheet.ciiva.com/22661/1563626-22661319.pdf?src-supplier=Element14; ComponentLink3URL: https://datasheet.ciiva.com/7660/1421516-7660807.pdf?src-supplier=Element14; ComponentLink3Description: https://datasheet.ciiva.com/7660/1421516-7660807.pdf?src-supplier=Element14; ComponentLink4URL: https://datasheet.ciiva.com/46391/1421516-46391339.pdf?src-supplier=Element14; ComponentLink4Description: https://datasheet.ciiva.com/46391/1421516-46391339.pdf?src-supplier=Element14; ComponentLink5URL: https://datasheet.ciiva.com/2467/pyu-r-int-thick-7-2467110.pdf?src-supplier=Digi-Key; ComponentLink5Description: https://datasheet.ciiva.com/2467/pyu-r-int-thick-7-2467110.pdf?src-supplier=Digi-Key; ComponentLink6URL: https://datasheet.ciiva.com/2467/pyu-r-int-thick-7-2467111.pdf?src-supplier=Digi-Key; ComponentLink6Description: https://datasheet.ciiva.com/2467/pyu-r-int-thick-7-2467111.pdf?src-supplier=Digi-Key; ComponentLink7URL: https://datasheet.ciiva.com/2467/pyu-r-int-thick-7-2467109.pdf?src-supplier=Digi-Key; ComponentLink7Description: https://datasheet.ciiva.com/2467/pyu-r-int-thick-7-2467109.pdf?src-supplier=Digi-Key; Supplier 1: Digi-Key; Supplier Part Number 1: YAG2831CT-ND; Stock 1: 99747; Pricing 1: 1=0,10000, 10=0,03700, 100=0,01500, 1000=0,00672, 2500=0,00583, 5000=0,00482 (USD); RoHS: Yes; Case/Package: 0201; Case Code (Metric): 0603; Case Code (Imperial): 0201; Min Operating Temperature: -55°C; Max Operating Temperature: 125°C; Tolerance: 1%; Packaging: Tape and Reel; Resistor Type: Thick Film; Number of Terminations: 2; Features: Moisture Resistant; Length: 0.024inch; Width: 0.012inch; Height: 0.01inch; Depth: 0.3mm; Military Standard: Not; RoHS Compliant: Yes; ComponentLink8URL: http://www.yageo.com/documents/recent/PYu-RC_Group_51_RoHS_L_9.pdf?src-supplier=Digi-Key; ComponentLink8Description: http://www.yageo.com/documents/recent/PYu-RC_Group_51_RoHS_L_9.pdf?src-supplier=Digi-Key; ComponentLink9URL: https://www.yageo.com/upload/media/product/productsearch/datasheet/rchip/PYu-RC_Group_51_RoHS_L_11.pdf?src-supplier=Digi-Key; ComponentLink9Description: https://www.yageo.com/upload/media/product/productsearch/datasheet/rchip/PYu-RC_Group_51_RoHS_L_11.pdf?src-supplier=Digi-Key
X5 = RF_IF_connector: CONN UMC RCPT STR 50 OHM SMD; Manufacturer: Molex, LLC; Manufacturer Part Number 1: 0734120110; Part Description: Ultra Miniature Coaxial Connector Receptacle, Male Pin 50 Ohm Surface Mount Solder; Body Finish: Nickel; Body Material: Phosphor Bronze; Center Contact Material: Brass; Center Contact Plating: Gold; Connector Style: Ultra Miniature Coaxial; Connector Type: Jack, Male Pin; Contact Termination: Solder; Dielectric Material: Liquid Crystal Polymer (LCP); Frequency - Max: 6GHz; Impedance: 50 Ohm; Voltage Rating: 60V; Cable Group: -; Category: Connectors, Interconnects; Fastening Type: Snap-On; Features: -; Housing Color: Silver; Ingress Protection: -; Mounting Type: Surface Mount; Operating Temperature: -40°C ~ 90°C; Packaging: Cut Tape (CT); RoHS: RoHS Compliant; Shield Termination: Solder; Supplier 1: Digi-Key; Supplier Part Number 1: WM5587CT-ND
X6 = RF_IF_connector: IPEX MHF4 Connector Jack, Male Pin 50 Ohms Surface Mount Solder; Manufacturer: TE Connectivity / Linx Technologies; Manufacturer Part Number 1: CONMHF4-SMD-G-T; Part Description: IPEX MHF4 Connector Jack, Male Pin 50 Ohms Surface Mount Solder; Pricing 1: 1=0,22 (USD); RoHS: No; Stock 1: 15668; Supplier 1: Digikey; Supplier Part Number 1: 343-CONMHF4-SMD-G-TCT-ND
X10 = PCIe_MiniCard_fingers: PCIe MiniCard full or half size
X11 = USB_Micro_TypeB_47346-0001: Connector SMD USB Micro Type B; Part Description: USB - micro B USB 2.0 Receptacle Connector 5 Position Surface Mount, Right Angle; Manufacturer: Molex; Supplier 1: Digi-Key; Supplier Part Number 1: WM17141CT-ND; Manufacturer Part Number 1: 47346-0001; Stock 1: 48746; Pricing 1: 1=1,66000, 10=1,41200, 100=1,16660, 1000=0,92100 (USD); RoHS: Yes; ComponentLink1URL: https://datasheet.ciiva.com/30075/304740473460001-io-nectors-30075527.pdf?src-supplier=Onlinecomponents.com; ComponentLink1Description: https://datasheet.ciiva.com/30075/304740473460001-io-nectors-30075527.pdf?src-supplier=Onlinecomponents.com; ComponentLink2URL: https://datasheet.ciiva.com/22654/1630785-22654942.pdf?src-supplier=Element14; ComponentLink2Description: https://datasheet.ciiva.com/22654/1630785-22654942.pdf?src-supplier=Element14; ComponentLink3URL: https://datasheet.ciiva.com/16148/1700180473460001-io-nectors-16148917.pdf?src-supplier=Onlinecomponents.com; ComponentLink3Description: https://datasheet.ciiva.com/16148/1700180473460001-io-nectors-16148917.pdf?src-supplier=Onlinecomponents.com; ComponentLink4URL: https://datasheet.ciiva.com/11731/0900766b80dfe0a7-11731298.pdf?src-supplier=RSComponents; ComponentLink4Description: https://datasheet.ciiva.com/11731/0900766b80dfe0a7-11731298.pdf?src-supplier=RSComponents; ComponentLink5URL: https://datasheet.ciiva.com/1098/1698067-1098476.pdf?src-supplier=Element14; ComponentLink5Description: https://datasheet.ciiva.com/1098/1698067-1098476.pdf?src-supplier=Element14; ComponentLink6URL: https://datasheet.ciiva.com/4598/0473460001-io-connectors-146446-4598841.pdf?src-supplier=Mouser; ComponentLink6Description: https://datasheet.ciiva.com/4598/0473460001-io-connectors-146446-4598841.pdf?src-supplier=Mouser; ComponentLink7URL: https://datasheet.ciiva.com/28504/0473460001-io-connectors-28504587.pdf?src-supplier=Element14; ComponentLink7Description: https://datasheet.ciiva.com/28504/0473460001-io-connectors-28504587.pdf?src-supplier=Element14; ComponentLink8URL: https://datasheet.ciiva.com/46390/1681853-46390956.pdf?src-supplier=Element14; ComponentLink8Description: https://datasheet.ciiva.com/46390/1681853-46390956.pdf?src-supplier=Element14; ComponentLink9URL: https://datasheet.ciiva.com/16986/70266948-16986683.pdf?src-supplier=Allied+Electronics; ComponentLink9Description: https://datasheet.ciiva.com/16986/70266948-16986683.pdf?src-supplier=Allied+Electronics
X12 = 503480-0800_8PIN_FPC_CONN: Part Description: 8 Position FFC, FPC Connector Contacts, Top and Bottom 0.020" (0.50mm) Surface Mount, Right Angle; Manufacturer: Molex; Supplier 1: Digi-Key; Supplier Part Number 1: WM1388CT-ND; Manufacturer Part Number 1: 503480-0800; Stock 1: 119007; Pricing 1: 1=0,92000, 10=0,76100, 100=0,63420, 1000=0,50736 (USD); RoHS: Yes; ComponentLink1URL: https://datasheet.ciiva.com/671/5034800400-sd-671136.pdf?src-supplier=Digi-Key; ComponentLink1Description: https://datasheet.ciiva.com/671/5034800400-sd-671136.pdf?src-supplier=Digi-Key; ComponentLink2URL: https://datasheet.ciiva.com/5751/1631789-5751170.pdf?src-supplier=Farnell; ComponentLink2Description: https://datasheet.ciiva.com/5751/1631789-5751170.pdf?src-supplier=Farnell; ComponentLink3URL: https://datasheet.ciiva.com/10363/5034800800-ffc-fpc-connectors-10363985.pdf?src-supplier=Avnet; ComponentLink3Description: https://datasheet.ciiva.com/10363/5034800800-ffc-fpc-connectors-10363985.pdf?src-supplier=Avnet; ComponentLink4URL: https://datasheet.ciiva.com/5138/5034800800-ffc-fpc-connectors-179547-5138276.pdf?src-supplier=Mouser; ComponentLink4Description: https://datasheet.ciiva.com/5138/5034800800-ffc-fpc-connectors-179547-5138276.pdf?src-supplier=Mouser; ComponentLink5URL: https://datasheet.ciiva.com/26825/getdatasheetpartid-495673-26825585.pdf?src-supplier=Verical; ComponentLink5Description: https://datasheet.ciiva.com/26825/getdatasheetpartid-495673-26825585.pdf?src-supplier=Verical